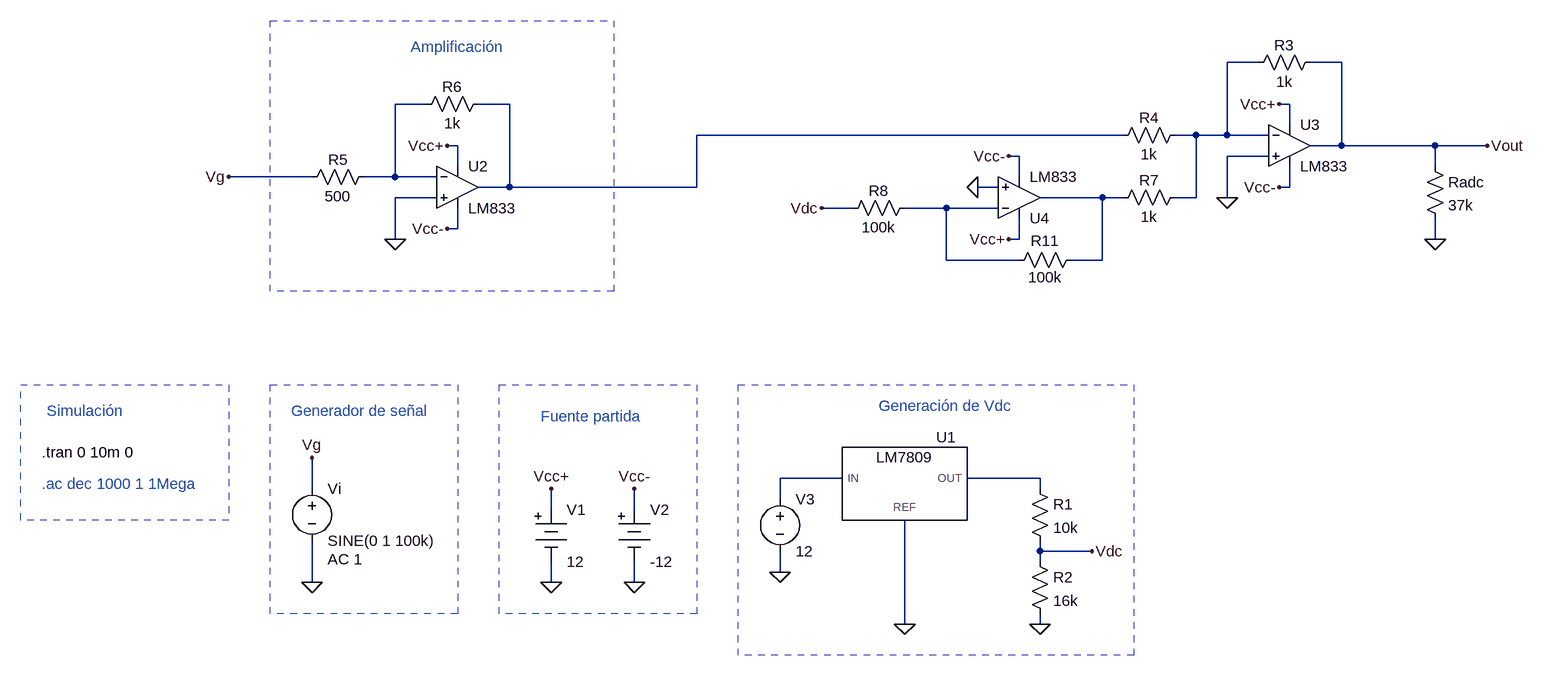
[diagram p0: schematic Etapa de Generacion v1.asc]
Etapa de Generacion v1.asc, the LTspice schematic file:
Version 4
SHEET 1 2568 1108
WIRE 1936 -16 1888 -16
WIRE 2064 -16 2016 -16
WIRE 656 48 608 48
WIRE 784 48 736 48
WIRE 1984 48 1968 48
WIRE 1984 80 1984 48
WIRE 1728 96 1072 96
WIRE 1840 96 1808 96
WIRE 1888 96 1888 -16
WIRE 1888 96 1840 96
WIRE 1952 96 1888 96
WIRE 704 112 688 112
WIRE 2064 112 2064 -16
WIRE 2064 112 2016 112
WIRE 2208 112 2064 112
WIRE 2288 112 2208 112
WIRE 1568 128 1552 128
WIRE 1952 128 1888 128
WIRE 704 144 704 112
WIRE 2208 144 2208 112
WIRE 480 160 352 160
WIRE 608 160 608 48
WIRE 608 160 560 160
WIRE 672 160 608 160
WIRE 1568 160 1568 128
WIRE 784 176 784 48
WIRE 784 176 736 176
WIRE 1072 176 1072 96
WIRE 1072 176 784 176
WIRE 1536 176 1504 176
WIRE 1984 176 1984 144
WIRE 1984 176 1968 176
WIRE 672 192 608 192
WIRE 1696 192 1600 192
WIRE 1728 192 1696 192
WIRE 1840 192 1840 96
WIRE 1840 192 1808 192
WIRE 1888 192 1888 128
WIRE 1312 208 1264 208
WIRE 1456 208 1392 208
WIRE 1536 208 1456 208
WIRE 704 240 704 208
WIRE 704 240 688 240
WIRE 608 256 608 192
WIRE 1568 256 1568 224
WIRE 1568 256 1552 256
WIRE 2208 256 2208 224
WIRE 1456 288 1456 208
WIRE 1568 288 1456 288
WIRE 1696 288 1696 192
WIRE 1696 288 1648 288
WIRE 1296 624 1200 624
WIRE 1600 624 1488 624
WIRE 480 640 480 592
WIRE 1600 640 1600 624
WIRE 1200 656 1200 624
WIRE 848 672 848 640
WIRE 976 672 976 640
WIRE 1600 736 1600 720
WIRE 1680 736 1600 736
WIRE 1600 752 1600 736
WIRE 1200 768 1200 736
WIRE 480 784 480 720
WIRE 848 784 848 752
WIRE 976 784 976 752
WIRE 1392 848 1392 688
WIRE 1600 848 1600 832
FLAG 480 592 Vg
FLAG 480 784 0
FLAG 2288 112 Vout
FLAG 848 640 Vcc+
FLAG 976 640 Vcc-
FLAG 976 784 0
FLAG 848 784 0
FLAG 608 256 0
FLAG 1200 768 0
FLAG 2208 256 0
FLAG 688 112 Vcc+
FLAG 688 240 Vcc-
FLAG 1888 192 0
FLAG 1968 48 Vcc+
FLAG 1968 176 Vcc-
FLAG 352 160 Vg
FLAG 1680 736 Vdc
FLAG 1600 848 0
FLAG 1392 848 0
FLAG 1552 256 Vcc+
FLAG 1552 128 Vcc-
FLAG 1504 176 0
FLAG 1264 208 Vdc
SYMBOL voltage 480 624 R0
WINDOW 123 24 124 Left 2
WINDOW 39 0 0 Left 0
SYMATTR Value2 AC 1
SYMATTR InstName Vi
SYMATTR Value SINE(0 1 100k)
SYMBOL Misc\\battery 848 656 R0
WINDOW 123 0 0 Left 0
WINDOW 39 0 0 Left 0
SYMATTR InstName V1
SYMATTR Value 12
SYMBOL Misc\\battery 976 656 R0
WINDOW 123 0 0 Left 0
WINDOW 39 0 0 Left 0
SYMATTR InstName V2
SYMATTR Value -12
SYMBOL res 464 176 R270
WINDOW 0 27 56 VTop 2
WINDOW 3 2 56 VBottom 2
SYMATTR InstName R5
SYMATTR Value 500
SYMBOL res 640 64 R270
WINDOW 0 27 56 VTop 2
WINDOW 3 2 56 VBottom 2
SYMATTR InstName R6
SYMATTR Value 1k
SYMBOL res 1712 208 R270
WINDOW 0 27 56 VTop 2
WINDOW 3 2 56 VBottom 2
SYMATTR InstName R7
SYMATTR Value 1k
SYMBOL voltage 1200 640 R0
WINDOW 123 0 0 Left 0
WINDOW 39 0 0 Left 0
SYMATTR InstName V3
SYMATTR Value 12
SYMBOL res 2192 128 R0
SYMATTR InstName Radc
SYMATTR Value 37k
SYMBOL res 1920 0 R270
WINDOW 0 27 56 VTop 2
WINDOW 3 2 56 VBottom 2
SYMATTR InstName R3
SYMATTR Value 1k
SYMBOL res 1712 112 R270
WINDOW 0 27 56 VTop 2
WINDOW 3 2 56 VBottom 2
SYMATTR InstName R4
SYMATTR Value 1k
SYMBOL TCLib\\LM833 704 176 R0
SYMATTR InstName U2
SYMBOL TCLib\\LM833 1984 112 R0
SYMATTR InstName U3
SYMBOL res 1584 624 R0
SYMATTR InstName R1
SYMATTR Value 10k
SYMBOL res 1584 736 R0
SYMATTR InstName R2
SYMATTR Value 16k
SYMBOL LM7809 1328 624 R0
SYMATTR InstName U1
SYMBOL TCLib\\LM833 1568 192 M180
SYMATTR InstName U4
SYMBOL res 1664 272 R90
WINDOW 0 2 56 VBottom 2
WINDOW 3 27 56 VTop 2
SYMATTR InstName R11
SYMATTR Value 100k
SYMBOL res 1296 224 R270
WINDOW 0 27 56 VTop 2
WINDOW 3 2 56 VBottom 2
SYMATTR InstName R8
SYMATTR Value 100k
TEXT 64 584 Left 2 !.tran 0 10m 0
TEXT 64 632 Left 2 ;.ac dec 1000 1 1Mega
TEXT 632 -40 Left 2 ;Amplificación
TEXT 1352 512 Left 2 ;Generación de Vdc
TEXT 832 528 Left 2 ;Fuente partida
TEXT 448 520 Left 2 ;Generador de señal
TEXT 72 520 Left 2 ;Simulación
RECTANGLE Normal 944 336 416 -80 3
RECTANGLE Normal 1744 896 1136 480 3
RECTANGLE Normal 1072 832 768 480 3
RECTANGLE Normal 704 832 416 480 3
RECTANGLE Normal 352 688 32 480 3

The netlist it stands for:
* Etapa de Generacion v1.asc
Vi Vg 0 SINE(0 1 100k) AC 1
V1 Vcc+ 0 12
V2 Vcc- 0 -12
R5 Vg N002 500
R6 N002 N003 1k
R7 N004 N001 1k
V3 N006 0 12
Radc Vout 0 37k
R3 N001 Vout 1k
R4 N003 N001 1k
* U2: LM833 (symbol TCLib\LM833 not available, pins judged from their places): In+=0 In-=N002 V+=Vcc+ V-=Vcc- OUT=N003
* U3: LM833 (symbol TCLib\LM833 not available, pins judged from their places): In+=0 In-=N001 V+=Vcc+ V-=Vcc- OUT=Vout
R1 N007 Vdc 10k
R2 Vdc 0 16k
XU1 N006 0 N007 LM7809  ; pins IN REF OUT
* U4: LM833 (symbol TCLib\LM833 not available, pins judged from their places): In+=0 In-=N005 V+=Vcc+ V-=Vcc- OUT=N004
R11 N004 N005 100k
R8 Vdc N005 100k
.tran 0 10m 0
* .ac dec 1000 1 1Mega
* Amplificación
* Generación de Vdc
* Fuente partida
* Generador de señal
* Simulación
.lib C:\Users\User\Repos\Biosc\Diseño\Etapa de Generación\7809.txt
.backanno
.end